# Altium schematic sheet GS-1.SchDoc
size A4
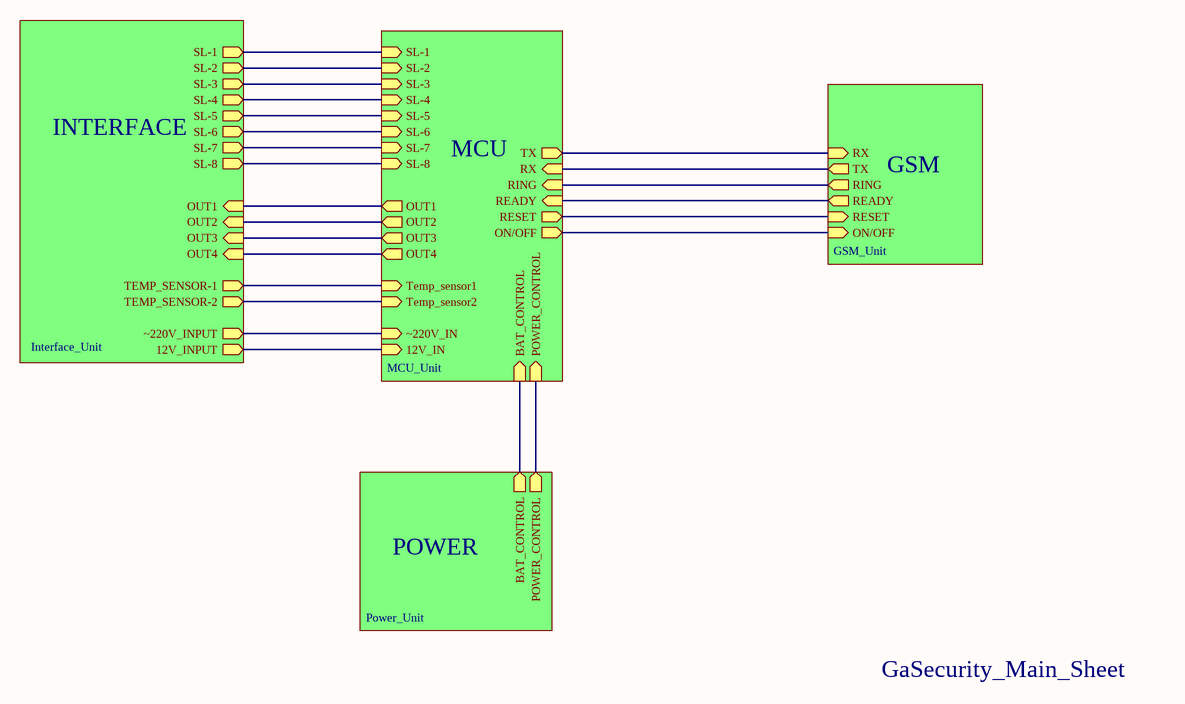
[diagram p0: GS-1.SchDoc]

## Sub-sheets
GSM = GSM_Unit: RX (in), TX (out), RING (out), READY (out), RESET (in), ON/OFF (in)
INTERFACE = Interface_Unit: SL-1 (out), SL-2 (out), SL-3 (out), SL-4 (out), SL-5 (out), SL-6 (out), SL-7 (out), SL-8 (out), OUT1 (in), OUT2 (in), OUT3 (in), OUT4 (in), TEMP_SENSOR-1 (out), TEMP_SENSOR-2 (out), ~220V_INPUT (out), 12V_INPUT (out)
MCU = MCU_Unit: TX (out), RX (in), ON/OFF (out), RESET (out), READY (in), RING (in), SL-1 (in), SL-2 (in), SL-3 (in), SL-4 (in), SL-5 (in), SL-6 (in), SL-7 (in), SL-8 (in), Temp_sensor1 (in), Temp_sensor2 (in), ~220V_IN (in), 12V_IN (in), OUT1 (out), OUT2 (out), OUT3 (out), OUT4 (out), BAT_CONTROL (in), POWER_CONTROL (in)
POWER = Power_Unit: POWER_CONTROL (out), BAT_CONTROL (out)

## Nets
(unnamed): sheet MCU/TX, sheet GSM/RX
(unnamed): sheet MCU/RX, sheet GSM/TX
(unnamed): sheet MCU/ON/OFF, sheet GSM/ON/OFF
(unnamed): sheet MCU/RESET, sheet GSM/RESET
(unnamed): sheet MCU/READY, sheet GSM/READY
(unnamed): sheet MCU/RING, sheet GSM/RING
(unnamed): sheet MCU/SL-1, sheet INTERFACE/SL-1
(unnamed): sheet MCU/SL-2, sheet INTERFACE/SL-2
(unnamed): sheet MCU/SL-3, sheet INTERFACE/SL-3
(unnamed): sheet MCU/SL-4, sheet INTERFACE/SL-4
(unnamed): sheet MCU/SL-5, sheet INTERFACE/SL-5
(unnamed): sheet MCU/SL-6, sheet INTERFACE/SL-6
(unnamed): sheet MCU/SL-7, sheet INTERFACE/SL-7
(unnamed): sheet MCU/SL-8, sheet INTERFACE/SL-8
(unnamed): sheet MCU/Temp_sensor1, sheet INTERFACE/TEMP_SENSOR-1
(unnamed): sheet MCU/Temp_sensor2, sheet INTERFACE/TEMP_SENSOR-2
(unnamed): sheet MCU/~220V_IN, sheet INTERFACE/~220V_INPUT
(unnamed): sheet MCU/12V_IN, sheet INTERFACE/12V_INPUT
(unnamed): sheet MCU/OUT1, sheet INTERFACE/OUT1
(unnamed): sheet MCU/OUT2, sheet INTERFACE/OUT2
(unnamed): sheet MCU/OUT3, sheet INTERFACE/OUT3
(unnamed): sheet MCU/OUT4, sheet INTERFACE/OUT4
(unnamed): sheet MCU/BAT_CONTROL, sheet POWER/BAT_CONTROL
(unnamed): sheet MCU/POWER_CONTROL, sheet POWER/POWER_CONTROL

## Notes on the sheet
- GaSecurity_Main_Sheet